# Altium schematic sheet 02. POWER.SchDoc
size A4; DocumentNumber: 2; SheetNumber: 2; SheetTotal: 12
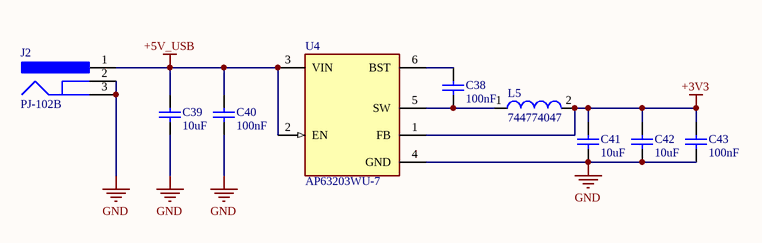
[diagram p0: 02. POWER.SchDoc]

## Parts
C38  100nF  [CAPC1005X56X25NL10T15]
C39  10uF  [CAPC1608X90X35NL10T15]
C40  100nF  [CAPC1005X56X25NL10T15]
C41  10uF  [CAPC1608X90X35NL10T15]
C42  10uF  [CAPC1608X90X35NL10T15]
C43  100nF  [CAPC1005X56X25NL10T15]
J2  PJ-102B  [CUI-PJ-102B_V]
L5  744774047  [WE-PD2-M]
U4  AP63203WU-7  [FP-TSOT26-IPC_B]

## Nets
+3V3: C41.2 C42.2 C43.2 L5.2 U4.1(FB)
+5V_USB: C39.2 C40.2 J2.1 U4.2(EN) U4.3(VIN)
GND: C39.1 C40.1 C41.1 C42.1 C43.1 J2.2 J2.3 U4.4(GND)
NetC38_1: C38.1 L5.1 U4.5(SW)
NetC38_2: C38.2 U4.6(BST)

## Notes on the sheet
- Title
- Size:
- Date:
- A4
- Number:
- Time:
- Revision:
- Sheet
- of
- N.S.T
- Design by:
- Check by:
- https://github.com/tung080827

## Library data of the parts
C38 C40 C43 = CMP-2008-02743-1: Manufacturer: AVX Interconnect / Elco; Part Number: 04026D104KAT2A
C39 C41 C42 = CMP-2006-02354-1: Manufacturer: Murata; Part Number: GCM188R70J225KE22D
J2 = CMP-2000-06900-1: Through Hole Right Angle DC Power Jack, 2.5 A, 2.5 mm Center Pin, 3 Position, -25 to 85 degC, RoHS, Bulk; Manufacturer: CUIInc.; Insulation Resistance: 100MOhms; Inside Contact Diameter: 2.5mm; Outside Contact Diameter: 6.5mm; Voltage Rating: 24V; Current Rating: 2.5A; Brand: CUI; Datasheet URL: http://www.cui.com/product/resource/pj-102b.pdf; Housing Material: PolybutyleneTerephthalate(PBT); Operating Temperature Range: -25Cto+85C; Package Reference: PJ-102B; Factory Pack Quantity: 280; RoHS: True; Contact Material: Copper; Datasheet Version: Rev. 1.03, 04/2016; Product: Jacks; Mounting Angle: Right; Mounting Style: ThroughHole; Flammability Rating: UL94V-0; Product Category: DCPowerConnectors; Contact Gender: Male; Termination Style: ThroughHole; Manufacturer URL: http://www.cui.com/; Mounting Technology: ThroughHole; Package Description: 3-Pin Through Hole Device, Body 14.4 x 9 mm, Height 11 mm; Contact Plating: Nickel; Packaging: Bulk; Connector Type: DCPowerJack
L5 = CMP-0227-00442-1: SMD Power Inductor WE-PD2, L = 4.70 µH; Inductance: 4.70 ÂµH; PackageVersion: 2005; PackageDescription: SMD Inductor, 2-Leads, Body 5.8 x 5.2 mm; ComponentLink2URL: http://www.we-online.de/katalog/media/pdf/744774047.pdf; ComponentLink1Description: Manufacturer Link; PackageReference: WE-PD2-M; DatasheetVersion: ver 2, Jun-2005; ComponentLink1URL: http://www.we-online.com; ComponentLink2Description: Datasheet
U4 = CMP-12757-000006-1: IC REG BUCK 3.3V 2A TSOT26; Manufacturer: Diodes Inc.; Output Type: Fixed; Min Supply Voltage: 3.8V; Number Of Outputs: 1; Max Junction Temp: +160°C; Nominal Supply Current: 22uA; Standoff Height: 0.01mm; Switching Frequency: 1.1MHz; Max Supply Voltage: 32V; ComponentLink2Description: Datasheet; Device Class L1: Integrated Circuits (ICs); Temperature: to +160°C; Device Class L3: Voltage Regulators - Switching; RoHS: TRUE; Octopart: https://octopart.com/ap63203wu-7-diodes+inc.-98099550; Output Voltage: 3.3V; Lead Free: Yes; ComponentLink2URL: https://www.diodes.com/assets/Datasheets/AP63200-AP63201-AP63203-AP63205.pdf; Digikey Description: IC REG BUCK 3.3V 2A TSOT26; Footprint Url: https://www.diodes.com/assets/Package-Files/TSOT26.pdf; Ambient Temperature Range High: +85°C; Height: 1mm; Automotive: No; Temperature Range High: +160°C; Switching Topology: Buck; Output Current: 2A; Package: TSOT26; Category: IC; Mouser Description: AP63203 Series 3.3 V 2 A SMT Fixed Low IQ Synchronous Buck - TSOT-26; Device Class L2: Power Management ICs; Ambient Temperature Range Low: -40°C; Manufacturer Part Number: AP63203WU-7